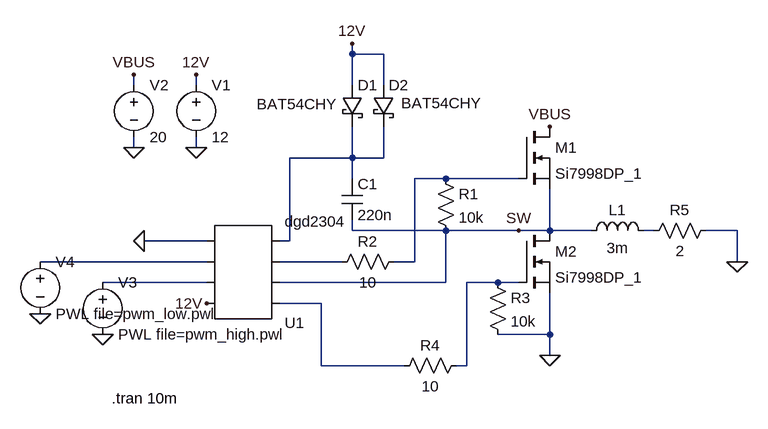
[diagram p0: schematic bootstrap.asc]
bootstrap.asc, the LTspice schematic file:
Version 4
SHEET 1 1004 788
WIRE 224 160 224 144
WIRE 272 160 224 160
WIRE -112 208 -112 192
WIRE -16 208 -16 192
WIRE 224 208 224 160
WIRE 272 208 272 160
WIRE -112 304 -112 288
WIRE -16 304 -16 288
WIRE 224 320 224 272
WIRE 224 320 128 320
WIRE 272 320 272 272
WIRE 272 320 224 320
WIRE 224 352 224 320
WIRE 368 352 320 352
WIRE 480 352 368 352
WIRE 224 432 224 416
WIRE 368 432 224 432
WIRE 480 432 368 432
WIRE 528 432 528 368
WIRE 528 432 480 432
WIRE 592 432 528 432
WIRE 688 432 672 432
WIRE 816 432 768 432
WIRE 0 448 -96 448
WIRE 128 448 128 320
WIRE 128 448 112 448
WIRE 0 480 -256 480
WIRE 208 480 112 480
WIRE 320 480 320 352
WIRE 320 480 288 480
WIRE 816 480 816 432
WIRE 0 512 -160 512
WIRE 368 512 368 432
WIRE 368 512 112 512
WIRE 448 512 400 512
WIRE 480 512 448 512
WIRE 176 544 112 544
WIRE 528 592 528 528
WIRE 528 592 448 592
WIRE 528 624 528 592
WIRE 176 640 176 544
WIRE 304 640 176 640
WIRE 400 640 400 512
WIRE 400 640 384 640
FLAG 224 144 12V
FLAG -16 304 0
FLAG -16 192 12V
FLAG -112 304 0
FLAG -112 192 VBUS
FLAG 528 272 VBUS
FLAG 480 432 SW
FLAG 528 624 0
FLAG 816 480 0
FLAG -96 448 0
FLAG 0 544 12V
FLAG -160 592 0
FLAG -256 560 0
SYMBOL schottky 208 208 R0
WINDOW 3 -131 29 Left 2
SYMATTR InstName D1
SYMATTR Value BAT54CHY
SYMATTR Description Diode
SYMATTR Type diode
SYMBOL schottky 256 208 R0
WINDOW 3 43 28 Left 2
SYMATTR InstName D2
SYMATTR Value BAT54CHY
SYMATTR Description Diode
SYMATTR Type diode
SYMBOL voltage -16 192 R0
WINDOW 123 0 0 Left 0
WINDOW 39 0 0 Left 0
SYMATTR InstName V1
SYMATTR Value 12
SYMBOL nmos 480 272 R0
SYMATTR InstName M1
SYMATTR Value Si7998DP_1
SYMBOL voltage -112 192 R0
WINDOW 123 0 0 Left 0
WINDOW 39 0 0 Left 0
SYMATTR InstName V2
SYMATTR Value 20
SYMBOL res 352 336 R0
SYMATTR InstName R1
SYMATTR Value 10k
SYMBOL cap 208 352 R0
SYMATTR InstName C1
SYMATTR Value 220n
SYMBOL res 304 464 R90
WINDOW 0 0 56 VBottom 2
WINDOW 3 32 56 VTop 2
SYMATTR InstName R2
SYMATTR Value 10
SYMBOL nmos 480 432 R0
SYMATTR InstName M2
SYMATTR Value Si7998DP_1
SYMBOL res 432 496 R0
SYMATTR InstName R3
SYMATTR Value 10k
SYMBOL res 400 624 R90
WINDOW 0 0 56 VBottom 2
WINDOW 3 32 56 VTop 2
SYMATTR InstName R4
SYMATTR Value 10
SYMBOL res 784 416 R90
WINDOW 0 0 56 VBottom 2
WINDOW 3 32 56 VTop 2
SYMATTR InstName R5
SYMATTR Value 2
SYMBOL ind 576 448 R270
WINDOW 0 32 56 VTop 2
WINDOW 3 5 56 VBottom 2
SYMATTR InstName L1
SYMATTR Value 3m
SYMBOL AutoGenerated\\dgd2304 48 496 M180
SYMATTR InstName U1
SYMBOL voltage -160 496 R0
WINDOW 123 0 0 Left 0
WINDOW 39 0 0 Left 0
SYMATTR InstName V3
SYMATTR Value PWL file=pwm_high.pwl
SYMBOL voltage -256 464 R0
WINDOW 123 0 0 Left 0
WINDOW 39 0 0 Left 0
SYMATTR InstName V4
SYMATTR Value PWL file=pwm_low.pwl
TEXT -146 690 Left 2 !.tran 10m

The netlist it stands for:
* bootstrap.asc
D1 12V N001 BAT54CHY
D2 12V N001 BAT54CHY
V1 12V 0 12
M1 VBUS N002 SW SW Si7998DP_1
V2 VBUS 0 20
R1 N002 SW 10k
C1 N001 SW 220n
R2 N002 N005 10
M2 SW N007 0 0 Si7998DP_1
R3 N007 0 10k
R4 N007 N008 10
R5 0 N003 2
L1 SW N003 3m
* U1: dgd2304 (symbol AutoGenerated\dgd2304 not available, pins judged from their places): pin1=12V pin2=N006 pin3=N004 pin4=0 pin5=N008 pin6=SW pin7=N005 pin8=N001
V3 N006 0 PWL file=pwm_high.pwl
V4 N004 0 PWL file=pwm_low.pwl
.model D D
.lib standard.dio
.model NMOS NMOS
.model PMOS PMOS
.lib standard.mos
.tran 10m
.backanno
.end